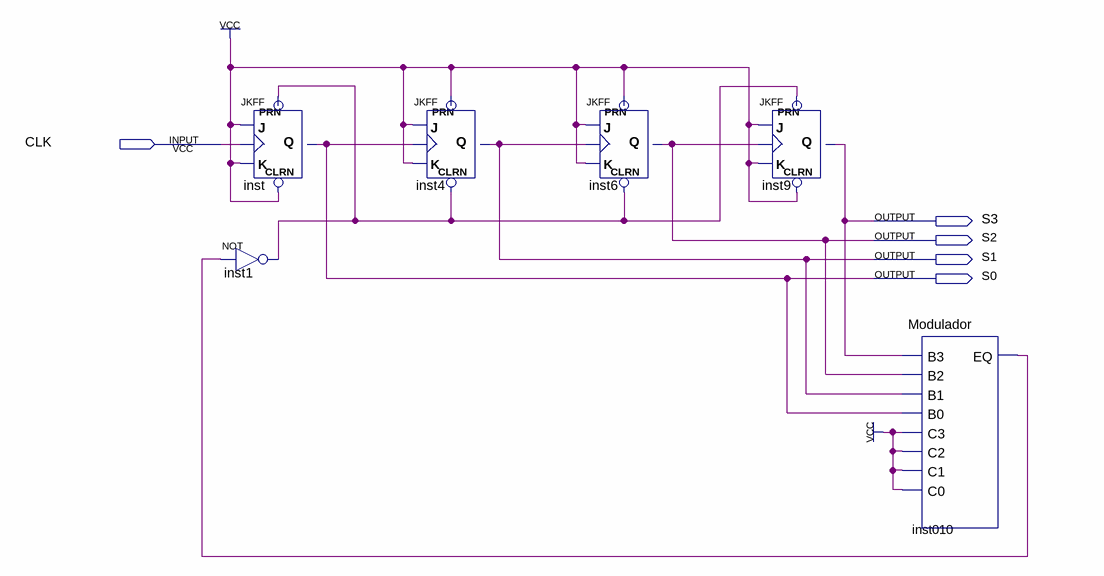
[diagram p0: schematic sheet]
// Quartus schematic Contador_Regressivo.bdf as structural Verilog: 6 symbols, 5 pins
module Contador_Regressivo (
  input  CLK,
  output S3,
  output S2,
  output S1,
  output S0
);

  wire inst1_out, inst010_eq;

  JKFF inst (.PRN(inst1_out), .CLRN(1'b1), .K(1'b1), .J(1'b1), .CLK(CLK), .Q(S0));
  not inst1 (inst1_out, inst010_eq);
  JKFF inst4 (.PRN(1'b1), .CLRN(inst1_out), .K(1'b1), .J(1'b1), .CLK(S0), .Q(S1));
  JKFF inst6 (.PRN(1'b1), .CLRN(inst1_out), .K(1'b1), .J(1'b1), .CLK(S1), .Q(S2));
  JKFF inst9 (.PRN(inst1_out), .CLRN(1'b1), .K(1'b1), .J(1'b1), .CLK(S2), .Q(S3));
  Modulador inst010 (.B3(S3), .B2(S2), .B1(S1), .B0(S0), .C3(1'b1), .C2(1'b1), .C1(1'b1), .C0(1'b1), .EQ(inst010_eq));
endmodule
